# EAGLE design remote (EAGLE 6.4)
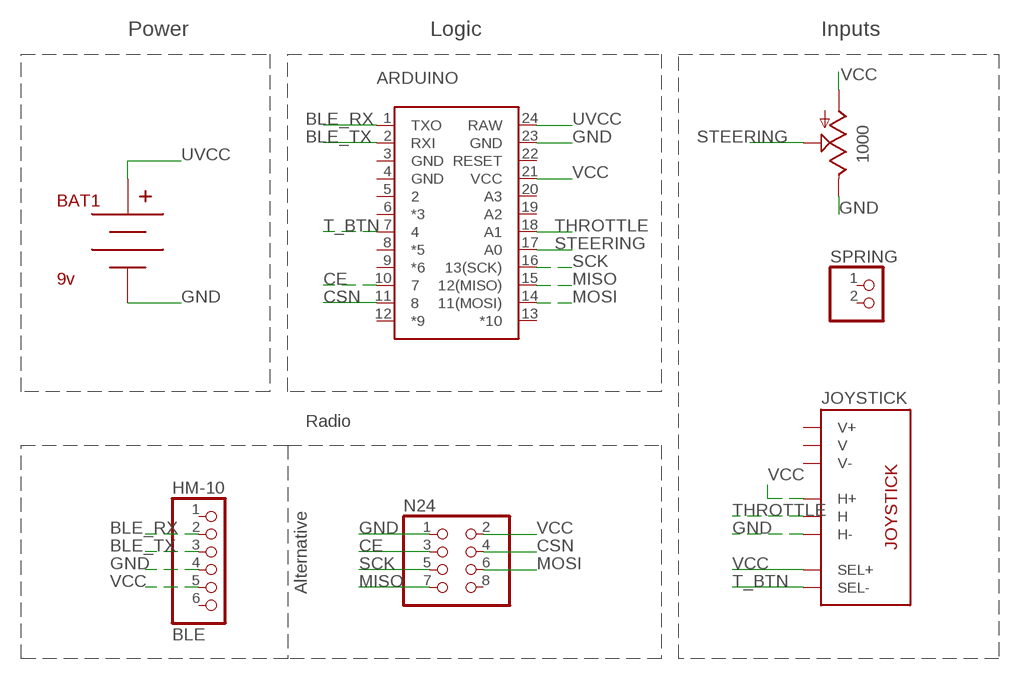
[diagram p0: schematic, sheet 1]

## Parts
ARDUINO  ARDUINO_PRO_MICRONORMALNORMAL  [ARDUINO_PRO_MICRO]
BAT1  9v  BC9VPC  [BC9VPC]
HM-10  BLE  PINHD-1X6B  [1X06-BIG]
JOYSTICK  JOYSTICK  JOYSTICKPTH  [JOYSTICK]
N24  NRF24  PINHD-2X4  [2X04]
RV1  1000  POTROBOTITALY  [ALPS_POT_2]
SPRING  PINHD-1X2  [1X02]

## Nets
BLE_RX: ARDUINO.1(TXO) HM-10.2
BLE_TX: ARDUINO.2(RXI) HM-10.3
CE: ARDUINO.10 N24.3
CSN: ARDUINO.11 N24.4
GND: ARDUINO.23(GND) BAT1.V- HM-10.4 JOYSTICK.H3(H-) N24.1 RV1.P$1(E)
MISO: ARDUINO.15(12(MISO)) N24.7
MOSI: ARDUINO.14(11(MOSI)) N24.6
SCK: ARDUINO.16(13(SCK)) N24.5
STEERING: ARDUINO.17(A0) RV1.P$2(S)
T_BTN: ARDUINO.7 JOYSTICK.B2A(SEL-)
THROTTLE: ARDUINO.18(A1) JOYSTICK.H2(H)
UVCC: ARDUINO.24(RAW) BAT1.V+
VCC: ARDUINO.21(VCC) HM-10.5 JOYSTICK.B1A(SEL+) JOYSTICK.H1(H+) N24.2 RV1.P$3(A)
Unconnected: ARDUINO.3(GND) ARDUINO.4(GND) ARDUINO.5 ARDUINO.6(*3) ARDUINO.8(*5) ARDUINO.9(*6) ARDUINO.12(*9) ARDUINO.13(*10) ARDUINO.19(A2) ARDUINO.20(A3) ARDUINO.22(RESET) HM-10.1 HM-10.6 JOYSTICK.V1(V+) JOYSTICK.V2(V) JOYSTICK.V3(V-) N24.8 SPRING.1 SPRING.2

## Notes on the sheet
- Power | Logic | Inputs
- Radio
- Alternative

## Library data of the parts
ARDUINO = SparkFun-Boards:ARDUINO_PRO_MICRO
BAT1 = SparkFun-Connectors:BC9VPC: 9V board-mount battery cradle; PROD_ID: BATT-10855
HM-10 = adafruit:PINHD-1X6: PIN HEADER
JOYSTICK = SparkFun-Electromechanical:JOYSTICK: Thumb Joystick Joystick commonly found in PS2 controllers. Two pots and a select switch. Footprint proven. Spark Fun Electronics SKU : COM-09032
N24 = pinhead:PINHD-2X4: PIN HEADER
RV1 = SparkFun-Electromechanical:POT
SPRING = pinhead:PINHD-1X2: PIN HEADER

## Board
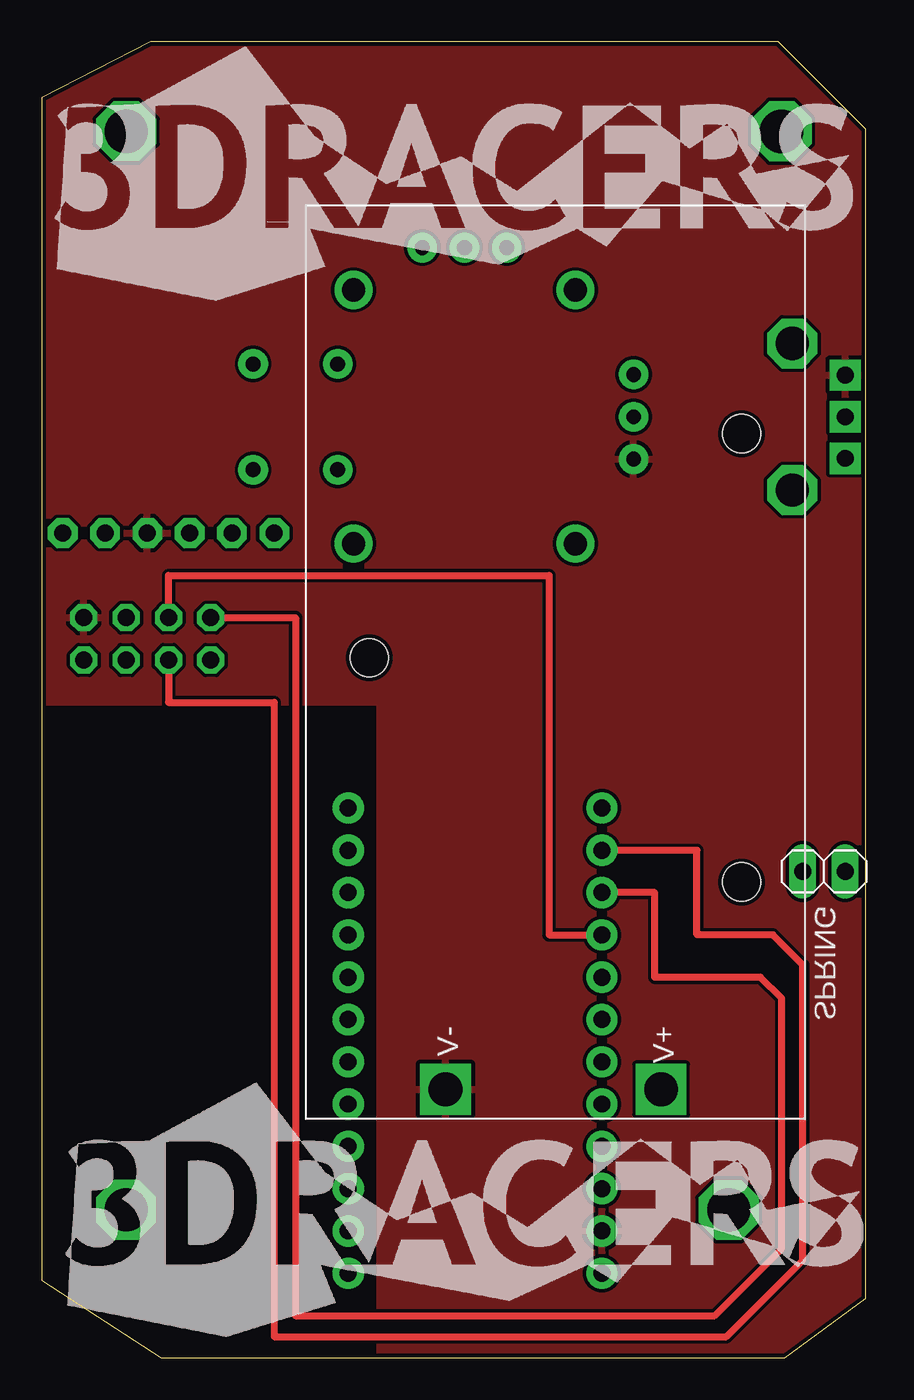
[diagram p1: board, top side]
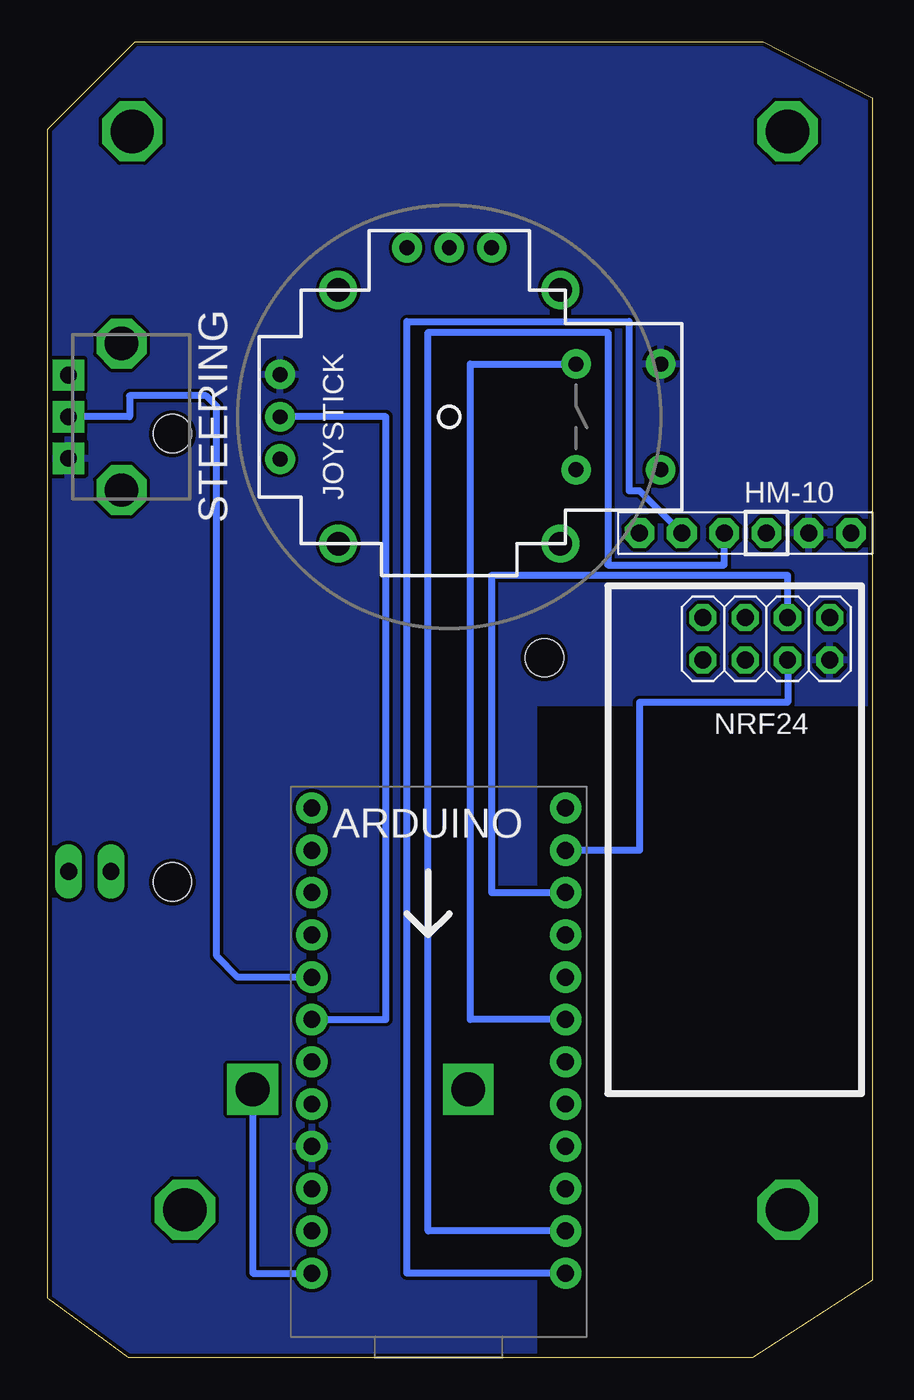
[diagram p2: board, bottom side, seen from below]

Size 49.51 x 79.05 mm. Coordinates in mm from the lower left corner, seen from the top.
Outline: 0,75.68 0,4.64 7.18,0 44.66,0 49.51,3.58 49.51,73.79 44.26,79.05 6.54,79.05 0,75.68
Copper layers (1*16): Top 0.035mm / dielectric 1.5mm / Bottom 0.035mm
Design rules "SparkFun *": minimum track width 8mil, minimum drill 20mil, track to track 8mil, track to pad 8mil, pad to pad 8mil, via to via 8mil, smd to smd 8mil, copper to edge 10mil, drill to drill 8mil, minimum pad ring 12mil, minimum via ring 10mil, stop-mask expansion 4mil, vias tented up to drill 25mil, thermal gap 10mil

### Footprints (pad centres in the part's own frame; a part is rotated, then mirrored left to right if it is on the bottom)
ARDUINO_PRO_MICRO = drill 1.016 pad 1.88: 1 -7.62,12.7; 2 -7.62,10.16; 3 -7.62,7.62; 4 -7.62,5.08; 5 -7.62,2.54; 6 -7.62,0; 7 -7.62,-2.54; 8 -7.62,-5.08; 9 -7.62,-7.62; 10 -7.62,-10.16; 11 -7.62,-12.7; 12 -7.62,-15.24; 13 7.62,-15.24; 14 7.62,-12.7; 15 7.62,-10.16; 16 7.62,-7.62; 17 7.62,-5.08; 18 7.62,-2.54; 19 7.62,0; 20 7.62,2.54; 21 7.62,5.08; 22 7.62,7.62; 23 7.62,10.16; 24 7.62,12.7
BC9VPC = drill 2.032 square: V+ 53.086,21.336; V- 53.086,8.382 | hole 2.286: 27.178,3.81; 13.716,26.162; 40.64,26.162
1X06-BIG = drill 1.016 pad 1.778 octagon: 1 -6.35,0; 2 -3.81,0; 3 -1.27,0; 4 1.27,0; 5 3.81,0; 6 6.35,0
JOYSTICK = drill 0.9 pad 1.778: B1A -3.175,12.7; B1B 3.175,12.7; B2A -3.175,7.62; B2B 3.175,7.62 | drill 0.889 pad 1.778: H1 -2.54,-10.16; H2 0,-10.16; H3 2.54,-10.16; V1 -10.16,2.54; V2 -10.16,0; V3 -10.16,-2.54 | drill 1.397 pad 2.286: MOUNT1 -7.62,6.668; MOUNT2 -7.62,-6.668; MOUNT3 7.62,-6.668; MOUNT4 7.62,6.668
2X04 = drill 1.016 octagon: 1 -3.81,-1.27; 2 -3.81,1.27; 3 -1.27,-1.27; 4 -1.27,1.27; 5 1.27,-1.27; 6 1.27,1.27; 7 3.81,-1.27; 8 3.81,1.27
ALPS_POT_2 = drill 1 pad 1.88 square: P$1 5.73,-2.5; P$2 5.73,0; P$3 5.73,2.5 | drill 2 octagon: P$4 2.54,-4.4; P$5 2.54,4.4
1X02 = drill 1.016 long: 1 -1.27,0; 2 1.27,0

### Placement (x,y rotation side)
ARDUINO  26.04,17.78 180 bottom
BAT1  15.88,69.22 270 top
HM-10  7.62,49.53 0 bottom
JOYSTICK  25.4,56.52 270 bottom
N24  6.35,43.18 180 bottom
RV1  42.55,56.52 180 bottom
SPRING  46.99,29.21 0 top

### Tracks (layer width: path | path; a pad name or v marks a point on that pad's centre or on a via)
BLE_RX
  Bottom 0.406: ARDUINO.1 27.94,5.08 27.94,62.23 14.61,62.23 14.61,52.07 13.97,52.07 HM-10.2
BLE_TX
  Bottom 0.406: ARDUINO.2 26.67,7.62 26.67,61.59 15.88,61.59 15.88,47.62 8.89,47.62 HM-10.3
CE
  Bottom 0.406: N24.3 5.08,46.99 22.86,46.99 22.86,27.94 ARDUINO.10 17.78,27.94
CSN
  Bottom 0.406: N24.4 5.08,39.37 13.97,39.37 13.97,30.48 ARDUINO.11
GND
  pour Top: -2.54,81.28 54.61,81.28 54.61,-2.54 20.32,-2.54 20.32,39.37 -2.54,39.37
MISO
  Top 0.406: N24.7 15.24,44.45 15.24,2.54 40.43,2.54 44.45,6.56 44.45,21.59 43.18,22.86 36.83,22.86 36.83,27.94 ARDUINO.15
MOSI
  Top 0.406: N24.6 7.62,39.37 13.97,39.37 13.97,1.27 41.14,1.27 45.72,5.85 45.72,23.6 43.92,25.4 39.37,25.4 39.37,30.48 ARDUINO.14
N$1  (via drill 2.6)
  other vias: 5.08,73.66
N$2  (via drill 2.6)
  other vias: 44.45,73.66
N$3  (via drill 2.6)
  other vias: 5.08,8.89
N$4  (via drill 2.6)
  other vias: 41.27,8.89
SCK
  Top 0.406: N24.5 7.62,46.99 30.48,46.99 30.48,25.4 ARDUINO.16
STEERING
  Bottom 0.406: ARDUINO.17 38.1,22.86 39.37,24.13 39.37,57.15 40.01,57.78 44.6,57.78 44.6,56.52 RV1.P$2
T_BTN
  Bottom 0.406: ARDUINO.7 24.13,20.32 24.13,59.69 JOYSTICK.B2A
THROTTLE
  Bottom 0.406: ARDUINO.18 29.21,20.32 29.21,56.52 JOYSTICK.H2
UVCC
  Bottom 0.406: BAT1.V+ 37.21,5.08 ARDUINO.24
VCC
  pour Bottom: -1.27,82.55 55.88,82.55 55.88,-1.27 20.32,-1.27 20.32,39.37 -1.27,39.37

### Text on the board
bNames: STEERING